# EAGLE design placa_painel (EAGLE 9.4.2)

## Sheet 1 of 2
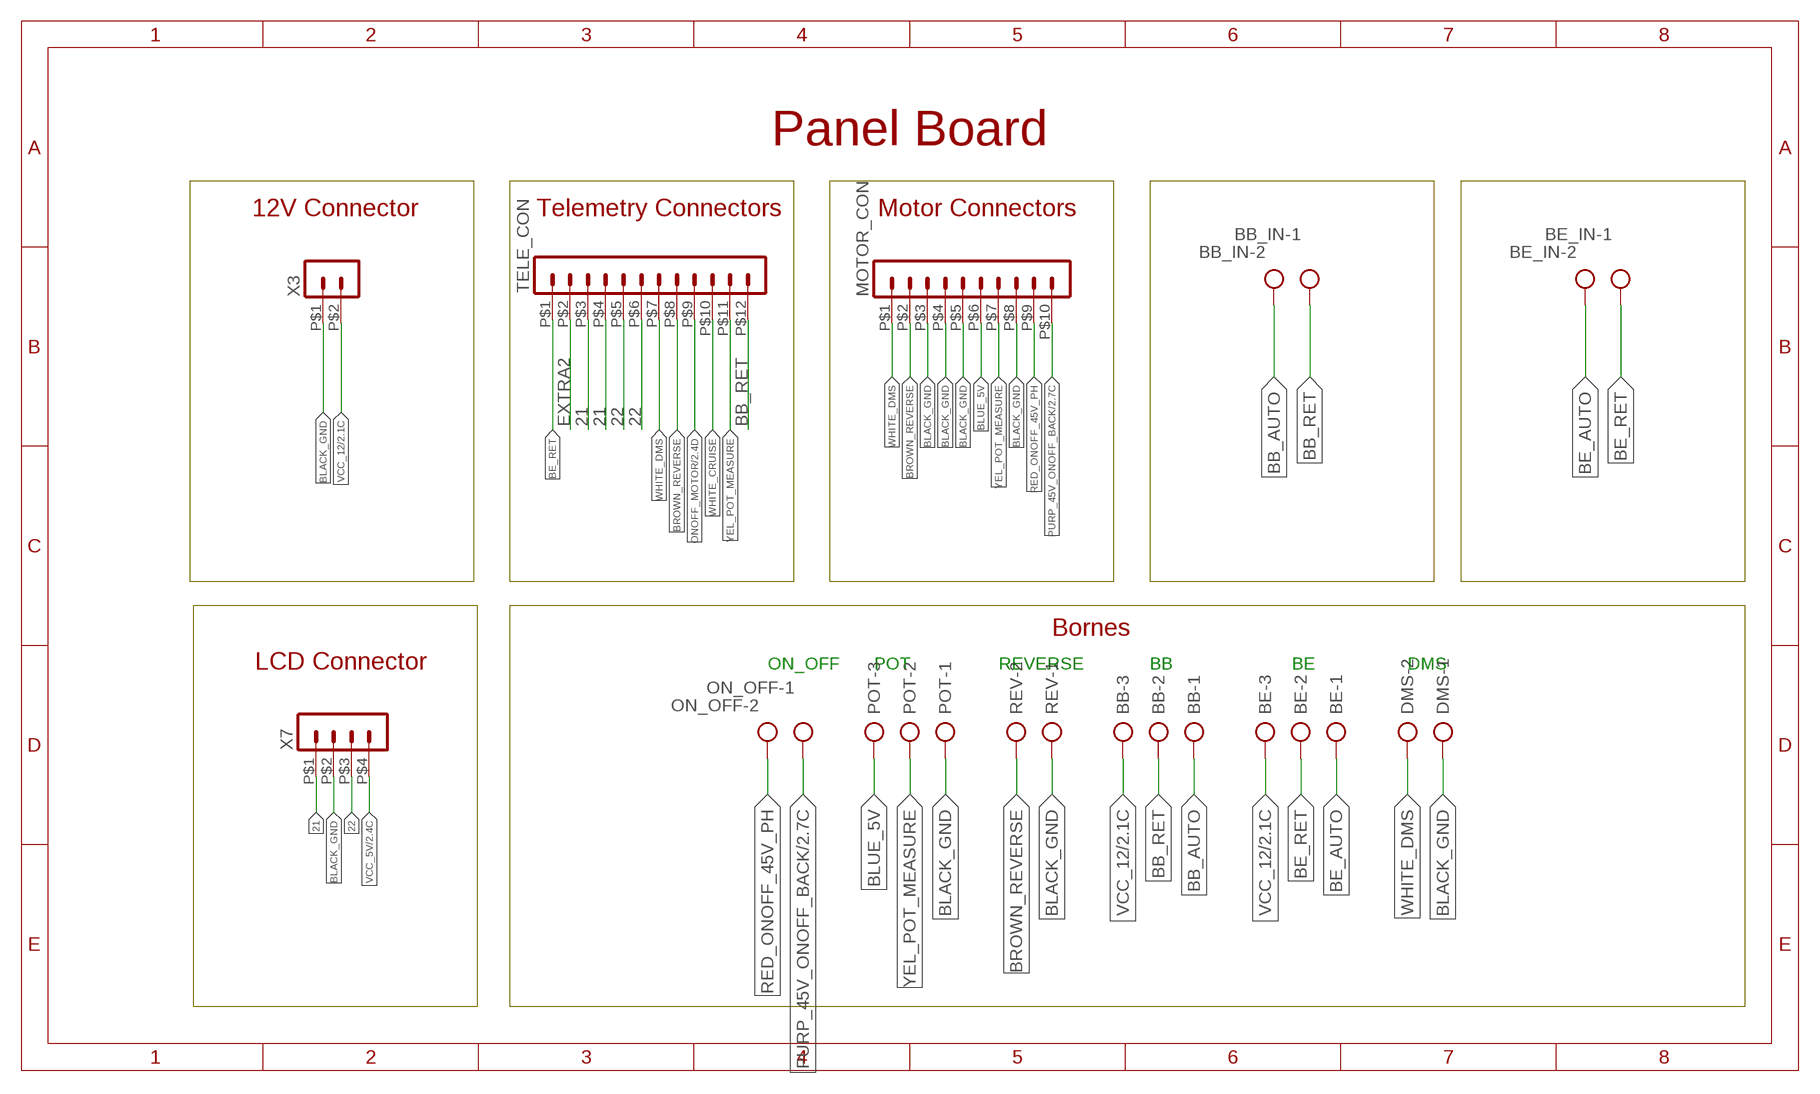
[diagram p0: schematic, sheet 1]

### Parts
BB  AK500/3  [AK500/3]
BB_IN  AK500/2  [AK500/2]
BE  AK500/3  [AK500/3]
BE_IN  AK500/2  [AK500/2]
DMS  AK500/2  [AK500/2]
MOTOR_CON  HEADER_POS10_43045-1012  [43045-1012]
ON_OFF  AK500/2  [AK500/2]
POT  AK500/3  [AK500/3]
REV  AK500/2  [AK500/2]
TELE_CON  HEADER_POS12_43045-1212  [43045-1212]
X3  HEADER_POS2_43045-0212  [43045-0212]
X7  HEADER_POS4_43045-0412  [43045-0412]

### Nets
21: TELE_CON.P$3 TELE_CON.P$4 X7.P$1
22: TELE_CON.P$5 TELE_CON.P$6 X7.P$3
BB_AUTO: BB.1 BB_IN.2
BB_RET: BB.2 BB_IN.1 TELE_CON.P$12
BE_AUTO: BE.1 BE_IN.2
BE_RET: BE.2 BE_IN.1 TELE_CON.P$1
BLACK_GND: DMS.1 MOTOR_CON.P$3 MOTOR_CON.P$4 MOTOR_CON.P$5 MOTOR_CON.P$8 POT.1 REV.1 X3.P$1 X7.P$2 ; also sheet 2
BLUE_5V: MOTOR_CON.P$6 POT.3
BROWN_REVERSE: MOTOR_CON.P$2 REV.2 TELE_CON.P$8
EXTRA2: TELE_CON.P$2
ONOFF_MOTOR: TELE_CON.P$9 ; also sheet 2
PURP_45V_ONOFF_BACK: MOTOR_CON.P$10 ON_OFF.1 ; also sheet 2
RED_ONOFF_45V_PH: MOTOR_CON.P$9 ON_OFF.2
VCC_5V: X7.P$4 ; also sheet 2
VCC_12: BB.3 BE.3 X3.P$2 ; also sheet 2
WHITE_CRUISE: TELE_CON.P$10
WHITE_DMS: DMS.2 MOTOR_CON.P$1 TELE_CON.P$7
YEL_POT_MEASURE: MOTOR_CON.P$7 POT.2 TELE_CON.P$11

### Notes on the sheet
- Panel Board
- 12V Connector | Telemetry Connectors | Motor Connectors
- Bornes
- LCD Connector
- ON_OFF | POT | REVERSE | BB | BE | DMS

## Sheet 2 of 2
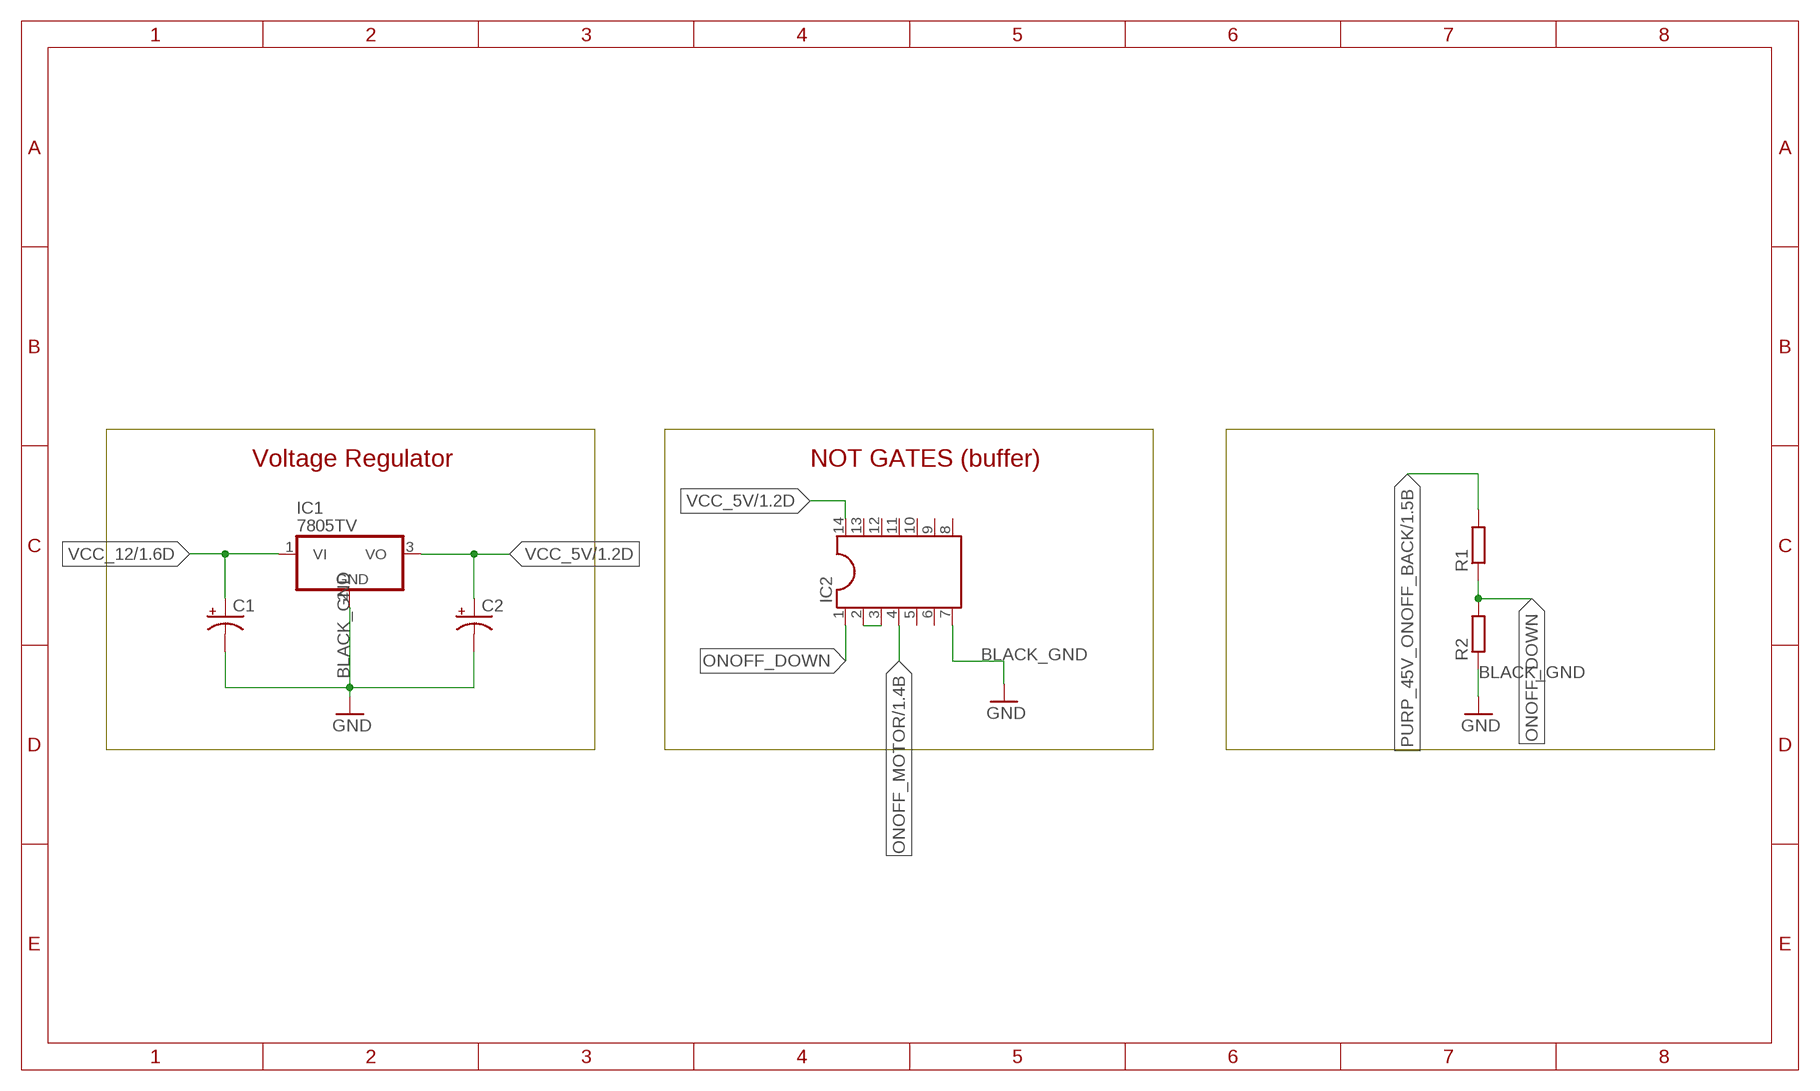
[diagram p1: schematic, sheet 2]

### Parts
C1  CPOL-USE5-5  [E5-5]
C2  CPOL-USE5-5  [E5-5]
IC1  7805TV  [TO220V]
IC2  DIL14  [DIL14]
R1  R-EU_0204/7  [0204/7]
R2  R-EU_0204/7  [0204/7]

### Nets
BLACK_GND: C1.- C2.- IC1.2(GND) IC2.7 R2.1 ; supply symbol labelled GND ; also sheet 1
N$4: IC2.2 IC2.3
ONOFF_DOWN: IC2.1 R1.1 R2.2
ONOFF_MOTOR: IC2.4 ; also sheet 1
PURP_45V_ONOFF_BACK: R1.2 ; also sheet 1
VCC_5V: C2.+ IC1.3(VO) IC2.14 ; also sheet 1
VCC_12: C1.+ IC1.1(VI) ; also sheet 1
Unconnected: IC2.5 IC2.6 IC2.8 IC2.9 IC2.10 IC2.11 IC2.12 IC2.13

### Notes on the sheet
- Voltage Regulator | NOT GATES (buffer)

## Library data of the parts
BB BE POT = con-ptr500:AK500/3: CONNECTOR; OC_FARNELL: unknown; OC_NEWARK: unknown
BB_IN BE_IN DMS ON_OFF REV = con-ptr500:AK500/2: CONNECTOR; OC_FARNELL: unknown; OC_NEWARK: unknown
C1 C2 = rcl:CPOL-US: POLARIZED CAPACITOR, American symbol; SPICEPREFIX: C
IC1 = linear:78*: Positive VOLTAGE REGULATOR Source: http://cache.national.com/ds/LM/LM78L05.pdf http://www.fairchildsemi.com/ds/LM/LM7805.pdf
IC2 = ic-package:DIL14: Dual In Line / Socket
MOTOR_CON = con-molex-micro-fit-3_0:HEADER_POS10_?: Molex - Micro-Fit 3.0 Series connector, 3.00mm (0.118") pitch header, 10 positions.
R1 R2 = rcl:R-EU_: RESISTOR, European symbol; SPICEPREFIX: R
TELE_CON = con-molex-micro-fit-3_0:HEADER_POS12_?: Molex - Micro-Fit 3.0 Series connector, 3.00mm (0.118") pitch header, 12 positions.
X3 = con-molex-micro-fit-3_0:HEADER_POS2_?: Molex - Micro-Fit 3.0 Series connector, 3.00mm (0.118") pitch header, 2 positions.
X7 = con-molex-micro-fit-3_0:HEADER_POS4_?: Molex - Micro-Fit 3.0 Series connector, 3.00mm (0.118") pitch header, 4 positions.

## Board
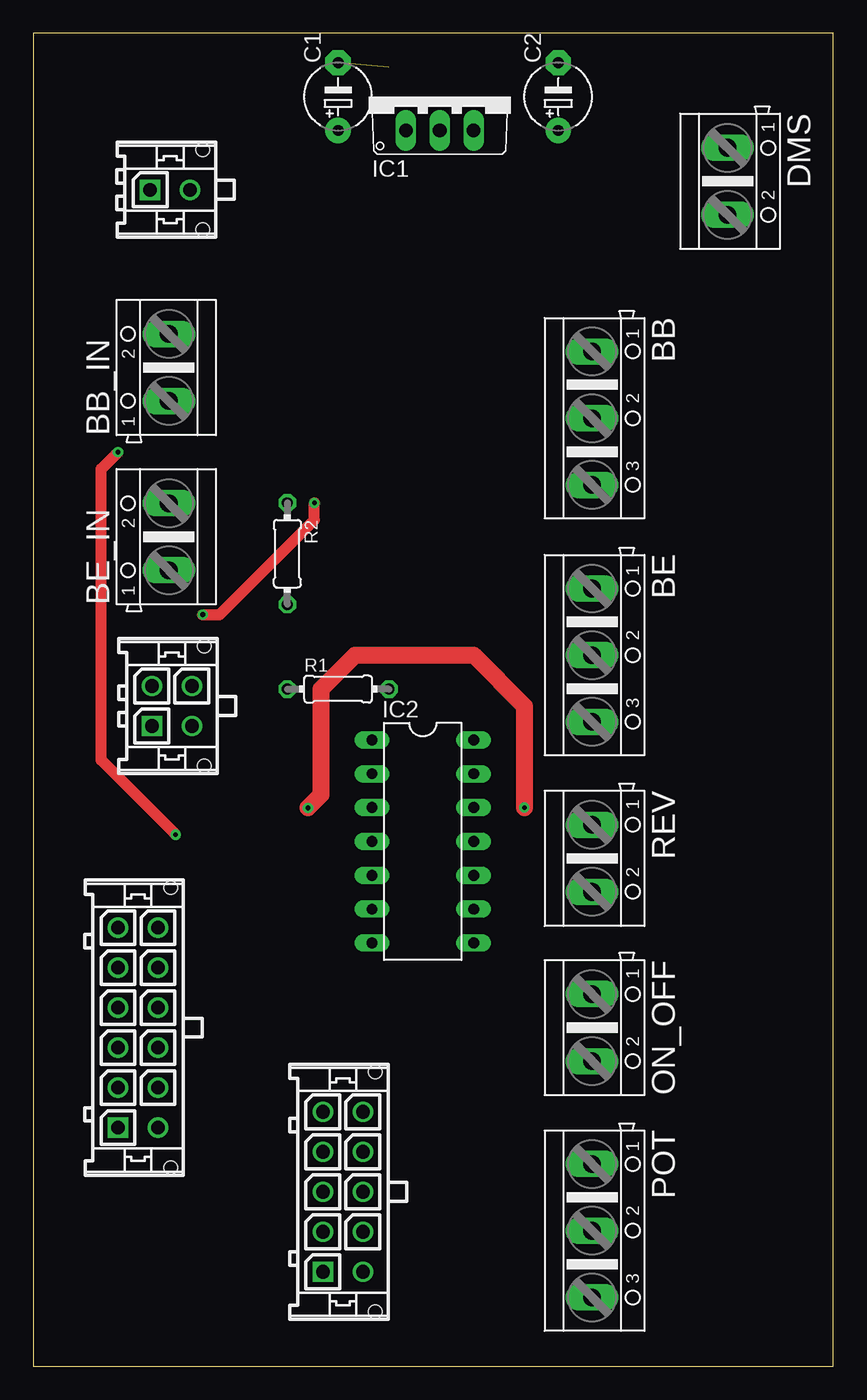
[diagram p2: board, top side]
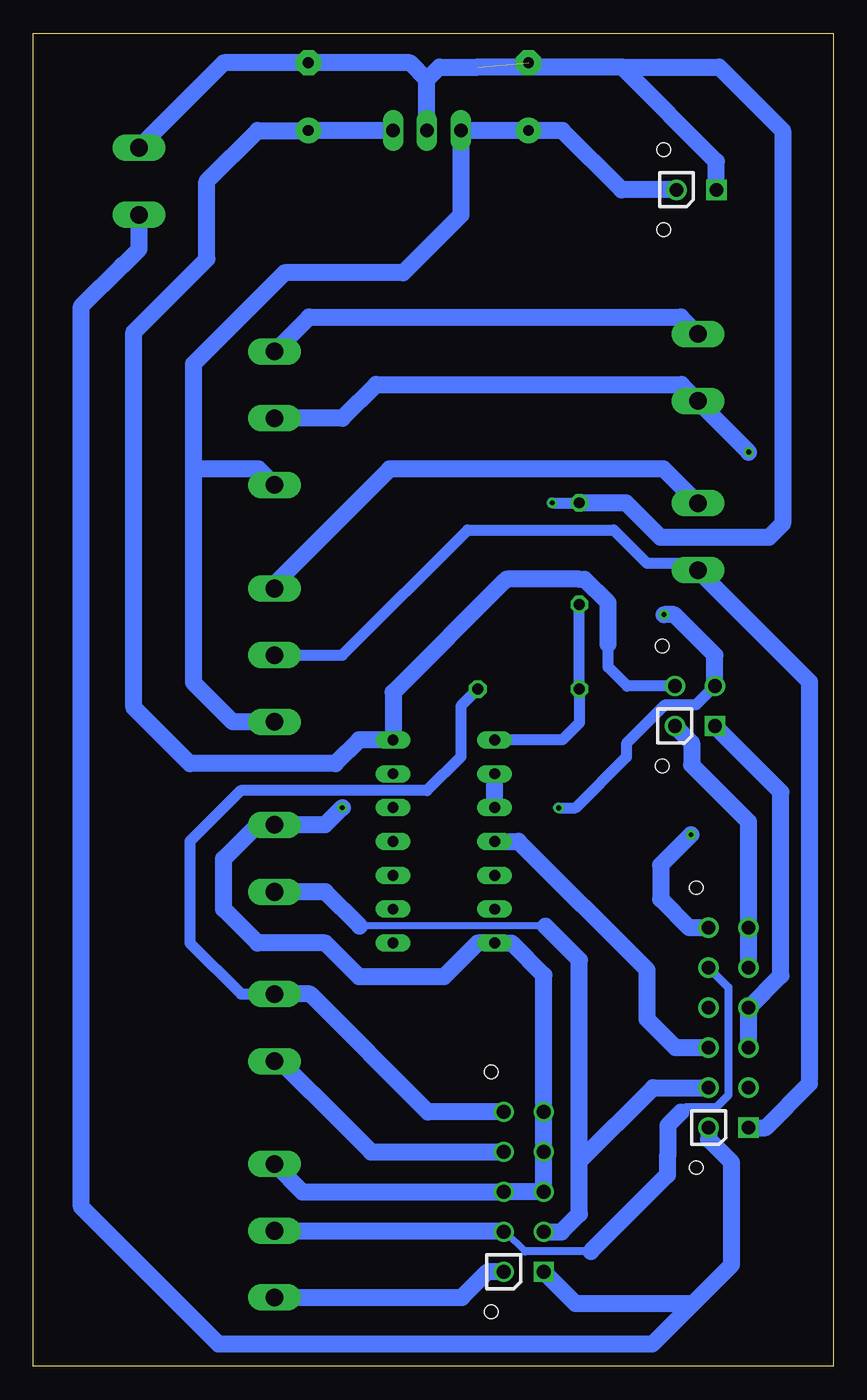
[diagram p3: board, bottom side, seen from below]

Size 60 x 100 mm. Coordinates in mm from the lower left corner, seen from the top.
Outline: 0,0 60,0 60,100 0,100 0,0
Copper layers (1*16): Top 0.035mm / dielectric 1.5mm / Bottom 0.035mm
Design rules "default": minimum track width 6mil, minimum drill 0.35mm, track to track 6mil, track to pad 6mil, pad to pad 6mil, via to via 6mil, smd to smd 6mil, copper to edge 40mil, drill to drill 6mil, minimum pad ring 10mil, minimum via ring 8mil, stop-mask expansion 4mil, vias tented up to drill 0mil, thermal gap 10mil

### Footprints (pad centres in the part's own frame; a part is rotated, then mirrored left to right if it is on the bottom)
AK500/3 = drill 1.321 long: 1 -5.004,0; 2 0,0; 3 5.004,0
AK500/2 = drill 1.321 long: 1 -2.515,0; 2 2.515,0
E5-5 = drill 0.813 pad 1.905: + -2.54,0 | drill 0.813 pad 1.905 octagon: - 2.54,0
TO220V = drill 1.016 long: 1 -2.54,-2.54; 2 0,-2.54; 3 2.54,-2.54
DIL14 = drill 0.813 long: 1 -7.62,-3.81; 2 -5.08,-3.81; 3 -2.54,-3.81; 4 0,-3.81; 5 2.54,-3.81; 6 5.08,-3.81; 7 7.62,-3.81; 8 7.62,3.81; 9 5.08,3.81; 10 2.54,3.81; 11 0,3.81; 12 -2.54,3.81; 13 -5.08,3.81; 14 -7.62,3.81
43045-1012 = drill 1.02 square: P$1 6,0 | drill 1.02: P$2 3,0; P$3 0,0; P$4 -3,0; P$5 -6,0; P$6 6,3; P$7 3,3; P$8 0,3; P$9 -3,3; P$10 -6,3 | hole 1.02: 9,3.94; -9,3.94
0204/7 = drill 0.813 octagon: 1 -3.81,0; 2 3.81,0
43045-1212 = drill 1.02 square: P$1 7.5,0 | drill 1.02: P$2 4.5,0; P$3 1.5,0; P$4 -1.5,0; P$5 -4.5,0; P$6 -7.5,0; P$7 7.5,3; P$8 4.5,3; P$9 1.5,3; P$10 -1.5,3; P$11 -4.5,3; P$12 -7.5,3 | hole 1.02: 10.5,3.94; -10.5,3.94
43045-0212 = drill 1.02 square: P$1 0,0 | drill 1.02: P$2 0,3 | hole 1.02: 3,3.94; -3,3.94
43045-0412 = drill 1.02 square: P$1 1.5,0 | drill 1.02: P$2 -1.5,0; P$3 1.5,3; P$4 -1.5,3 | hole 1.02: 4.5,3.94; -4.5,3.94

### Placement (x,y rotation side)
BB  41.91,71.12 270 top
BB_IN  10.16,74.93 90 top
BE  41.91,53.34 270 top
BE_IN  10.16,62.23 90 top
C1  22.86,95.25 90 top
C2  39.37,95.25 90 top
DMS  52.07,88.9 270 top
IC1  30.48,95.25 0 top
IC2  29.21,39.37 270 top
MOTOR_CON  21.72,13.08 270 top
ON_OFF  41.91,25.4 270 top
POT  41.91,10.16 270 top
R1  22.86,50.8 0 top
R2  19.05,60.96 270 top
REV  41.91,38.1 270 top
TELE_CON  6.35,25.4 270 top
X3  8.76,88.27 270 top
X7  8.89,49.53 270 top

### Tracks (layer width: path | path; a pad name or v marks a point on that pad's centre or on a via)
21
  Bottom 1.27: TELE_CON.P$3 TELE_CON.P$4 3.94,29.31 3.94,43.08 X7.P$1
22
  Bottom 1.27: TELE_CON.P$5 TELE_CON.P$6 6.35,40.84 10.62,45.11 10.62,46.76 X7.P$3
BB_AUTO
  Bottom 1.27: BB_IN.2 11.43,78.72 39.32,78.72 BB.1
BB_RET  (via drill 0.35)
  Top 0.813: v10.67,39.88 5.08,45.47 5.08,67.31 v6.35,68.58
  Bottom 0.813: 10.16,72.39 BB_IN.1
  Bottom 1.27: BB.2 36.83,71.12 34.29,73.66 11.4,73.66 BB_IN.1 | v6.35,68.58 10.16,72.39 | TELE_CON.P$12 10.8,32.9 12.95,35.05 12.95,37.59 v10.67,39.88
BE_AUTO
  Bottom 1.27: BE_IN.2 12.72,67.31 33.27,67.31 41.91,58.67 BE.1
BE_RET
  Bottom 0.813: BE_IN.1 10.67,60.22 13.97,60.22 16.48,62.74 27.43,62.74 36.83,53.34 BE.2 | 1.78,21.2 1.78,21.59
  Bottom 1.27: TELE_CON.P$1 5.08,17.9 1.78,21.2 | 1.78,21.59 1.78,51.33 BE_IN.1
BLACK_GND  (via drill 0.35)  (1 unrouted)
  Top 0.813: v12.7,56.39 13.97,56.39 21.08,63.5 v21.08,64.77
  Top 1.27: v20.6,41.88 21.59,42.88 21.59,50.8 24.13,53.34 33.02,53.34 36.83,49.53 v36.83,41.91
  Bottom 0.508: 26.67,97.46 28.75,97.46
  Bottom 0.813: v21.08,64.77 R2.1 | 45.72,34.29 45.72,38.08 45.71,38.09 43.18,40.62 | v20.6,41.88 19.33,41.88 15.52,45.7 15.52,46.71 12.6,49.63 10.29,49.63 X7.P$2
  Bottom 1.27: POT.1 39.83,13.08 MOTOR_CON.P$8 MOTOR_CON.P$3 MOTOR_CON.P$4 MOTOR_CON.P$5 21.72,29.34 24.13,31.75 IC2.7 26.67,31.75 29.21,29.21 35.56,29.21 38.1,31.75 43.18,31.75 45.72,34.29 45.71,34.3 45.71,38.09 | 30.48,96.52 29.54,97.46 26.67,97.46 15.84,97.46 | 15.84,97.46 8.56,97.46 3.8,92.7 3.8,63.21 4.83,62.18 12.95,62.18 15.54,64.77 R2.1 | IC1.2 30.48,96.52 | 30.48,96.52 31.75,97.79 C2.- 45.72,97.79 52.07,91.44 DMS.1 | X3.P$1 8.76,90.38 15.84,97.46 | X7.P$2 8.89,53.34 11.94,56.39 v12.7,56.39 | 45.72,38.08 43.18,40.62 REV.1 38.12,40.62 v36.83,41.91
BLUE_5V
  Bottom 1.27: MOTOR_CON.P$6 25.94,7.08 27.86,5.16 POT.3
BROWN_REVERSE
  Bottom 0.508: 21.59,33.02 35.53,33.02
  Bottom 1.27: MOTOR_CON.P$2 20.4,10.08 19.05,11.43 19.05,15.37 | 19.05,15.37 13.52,20.9 TELE_CON.P$8 | 19.05,15.37 19.05,30.48 21.59,33.02 | 35.53,33.02 38.1,35.59 REV.2
N$4
  Bottom 1.27: IC2.3 IC2.2
ONOFF_DOWN
  Bottom 0.813: R2.2 R1.1 19.05,48.26 20.32,46.99 IC2.1
ONOFF_MOTOR
  Bottom 1.27: TELE_CON.P$9 11.84,23.9 13.97,26.04 13.97,29.72 23.62,39.37 IC2.4
PURP_45V_ONOFF_BACK
  Bottom 0.813: R1.2 27.94,49.53 27.94,45.72 30.48,43.18 44.45,43.18 48.26,39.37 48.26,31.75 44.42,27.91 ON_OFF.1
  Bottom 1.27: 40.62,27.91 ON_OFF.1 39.24,27.91 30.41,19.08 MOTOR_CON.P$10
RED_ONOFF_45V_PH
  Bottom 0.508: 37.27,18.24 36.83,18.24
  Bottom 1.27: MOTOR_CON.P$9 34.67,16.08 36.83,18.24 41.48,22.89 ON_OFF.2
VCC_5V
  Bottom 0.508: IC2.14 33.27,46.99 33.66,46.61
  Bottom 0.813: X7.P$4 15.47,51.03 16.89,52.45 16.89,54.17
  Bottom 1.016: 18.67,59.05 19.05,59.05 | 24.51,59.05 24.64,58.93
  Bottom 1.27: IC1.3 C2.+ 43.18,92.71 46.99,88.9 46.99,83.06 52.45,77.6 52.45,49.4 48.26,45.21 37.34,45.21 35.56,46.99 IC2.14 33.02,50.55 24.64,58.93 | 16.89,54.17 16.89,57.28 18.67,59.05 | 19.05,59.05 24.51,59.05
VCC_12
  Bottom 1.27: X3.P$2 15.88,88.27 20.32,92.71 C1.+ IC1.1 27.94,86.36 32.26,82.04 41.15,82.04 48.01,75.18 48.01,67.31 | BB.3 43.1,67.31 48.01,67.31 | BE.3 45.03,48.34 48.01,51.31 48.01,67.31
WHITE_DMS
  Bottom 1.27: 10.54,4.7 13.59,1.65 46.1,1.65 56.39,11.94 56.39,79.53 53.34,82.58 53.34,82.55 52.07,83.82 DMS.2 | 21.46,6.83 MOTOR_CON.P$1 19.34,4.7 10.54,4.7 | 10.54,4.7 7.62,7.62 7.62,15.29 9.35,17.02 TELE_CON.P$7
YEL_POT_MEASURE
  Bottom 0.508: MOTOR_CON.P$7 24.59,10.08 23.11,8.61 | 12.42,18.06 12.42,17.78 | 7.87,22.86 7.87,22.61
  Bottom 0.61: 11.43,19.05 11.05,19.43 8.76,19.43 7.87,20.32 7.87,22.86 7.87,28.42 TELE_CON.P$11 | 18.19,8.61 23.11,8.61
  Bottom 1.27: POT.2 24.8,10.16 MOTOR_CON.P$7 | 11.43,19.05 12.42,18.06 | 12.42,17.78 12.42,15.83 12.45,15.79 12.45,14.35 18.19,8.61